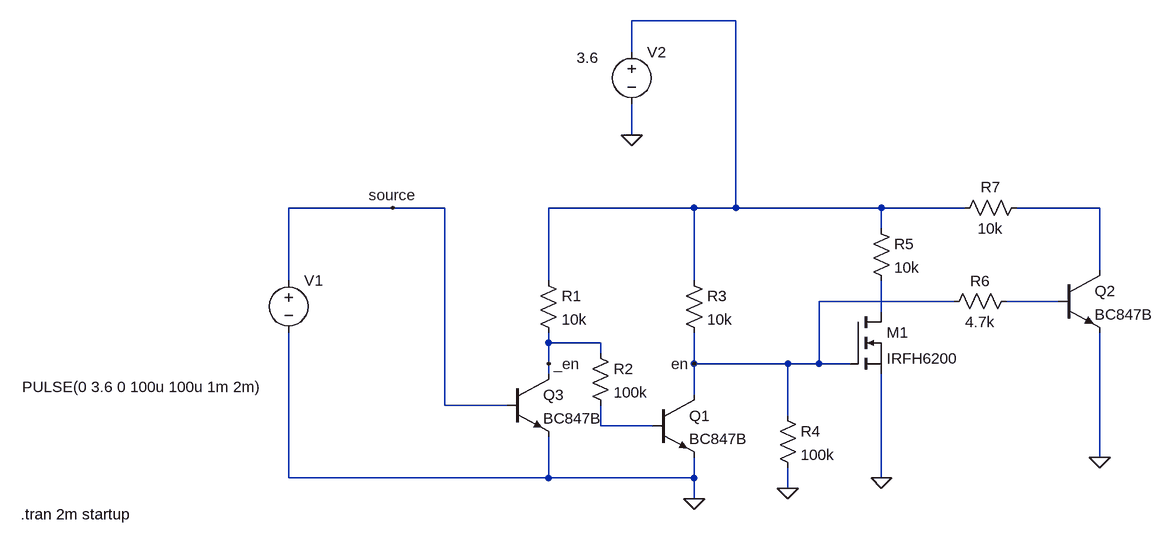
[diagram p0: schematic Draft1.asc]
Draft1.asc, the LTspice schematic file:
Version 4
SHEET 1 1448 680
WIRE 800 -224 640 -224
WIRE 640 -176 640 -224
WIRE 640 -48 640 -96
WIRE 272 64 112 64
WIRE 352 64 272 64
WIRE 736 64 512 64
WIRE 800 64 800 -224
WIRE 800 64 736 64
WIRE 1024 64 800 64
WIRE 1152 64 1024 64
WIRE 1360 64 1232 64
WIRE 1024 96 1024 64
WIRE 1360 160 1360 64
WIRE 112 176 112 64
WIRE 512 176 512 64
WIRE 736 176 736 64
WIRE 1136 208 928 208
WIRE 1296 208 1216 208
WIRE 1024 224 1024 176
WIRE 512 272 512 256
WIRE 592 272 512 272
WIRE 592 288 592 272
WIRE 512 304 512 272
WIRE 736 304 736 256
WIRE 880 304 736 304
WIRE 928 304 928 208
WIRE 928 304 880 304
WIRE 976 304 928 304
WIRE 512 320 512 304
WIRE 736 352 736 304
WIRE 352 368 352 64
WIRE 448 368 352 368
WIRE 880 384 880 304
WIRE 592 400 592 368
WIRE 672 400 592 400
WIRE 1360 448 1360 256
WIRE 112 480 112 256
WIRE 512 480 512 416
WIRE 512 480 112 480
WIRE 736 480 736 448
WIRE 736 480 512 480
WIRE 1024 480 1024 320
WIRE 880 496 880 464
WIRE 736 512 736 480
FLAG 736 512 0
FLAG 736 304 en
FLAG 880 496 0
FLAG 1024 480 0
FLAG 1360 448 0
FLAG 640 -48 0
FLAG 512 304 _en
FLAG 272 64 source
SYMBOL voltage 112 160 R0
WINDOW 3 -410 180 Left 2
WINDOW 123 0 0 Left 0
WINDOW 39 0 0 Left 0
SYMATTR InstName V1
SYMATTR Value PULSE(0 3.6 0 100u 100u 1m 2m)
SYMBOL res 496 160 R0
SYMATTR InstName R1
SYMATTR Value 10k
SYMBOL npn 672 352 R0
SYMATTR InstName Q1
SYMATTR Value BC847B
SYMBOL res 576 272 R0
SYMATTR InstName R2
SYMATTR Value 100k
SYMBOL res 720 160 R0
SYMATTR InstName R3
SYMATTR Value 10k
SYMBOL res 864 368 R0
SYMATTR InstName R4
SYMATTR Value 100k
SYMBOL nmos 976 224 R0
SYMATTR InstName M1
SYMATTR Value IRFH6200
SYMBOL res 1008 80 R0
SYMATTR InstName R5
SYMATTR Value 10k
SYMBOL npn 1296 160 R0
SYMATTR InstName Q2
SYMATTR Value BC847B
SYMBOL res 1232 192 R90
WINDOW 0 0 56 VBottom 2
WINDOW 3 32 56 VTop 2
SYMATTR InstName R6
SYMATTR Value 4.7k
SYMBOL res 1248 48 R90
WINDOW 0 0 56 VBottom 2
WINDOW 3 32 56 VTop 2
SYMATTR InstName R7
SYMATTR Value 10k
SYMBOL voltage 640 -192 R0
WINDOW 3 -85 25 Left 2
WINDOW 123 0 0 Left 0
WINDOW 39 0 0 Left 0
SYMATTR InstName V2
SYMATTR Value 3.6
SYMBOL npn 448 320 R0
SYMATTR InstName Q3
SYMATTR Value BC847B
TEXT -300 536 Left 2 !.tran 2m startup

The netlist it stands for:
* Draft1.asc
V1 source 0 PULSE(0 3.6 0 100u 100u 1m 2m)
R1 N001 _en 10k
Q1 en N005 0 0 BC847B
R2 _en N005 100k
R3 N001 en 10k
R4 en 0 100k
M1 N004 en 0 0 IRFH6200
R5 N001 N004 10k
Q2 N002 N003 0 0 BC847B
R6 N003 en 4.7k
R7 N002 N001 10k
V2 N001 0 3.6
Q3 _en source 0 0 BC847B
.model NPN NPN
.model PNP PNP
.lib standard.bjt
.model NMOS NMOS
.model PMOS PMOS
.lib standard.mos
.tran 2m startup
.backanno
.end